# Altium schematic sheet Keys.SchDoc
size A4
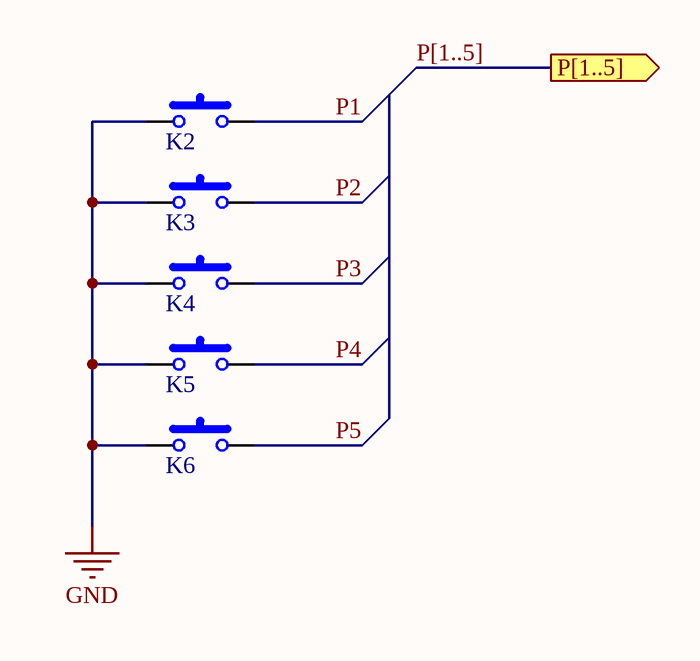
[diagram p0: Keys.SchDoc]

## Parts
K2  KEY  [TACK6]  (value not drawn)
K3  KEY  [TACK6]  (value not drawn)
K4  KEY  [TACK6]  (value not drawn)
K5  KEY  [TACK6]  (value not drawn)
K6  KEY  [TACK6]  (value not drawn)

## Ports
P[1..5] (out)

## Nets
GND: K2.1 K3.1 K4.1 K5.1 K6.1
P1: K2.2
P2: K3.2
P3: K4.2
P4: K5.2
P5: K6.2

## Buses and harness runs
bus P[1..5] = port P[1..5]

## Library data of the parts
K2-K6 = KEY: Switch; Published: 24-Mar-1999; LatestRevisionDate: 17-Jul-2002; LatestRevisionNote: Re-released for DXP Platform.; PackageReference: SPST-2; Publisher: Altium Limited